# EAGLE design Duino Miner (EAGLE 9.6.2)
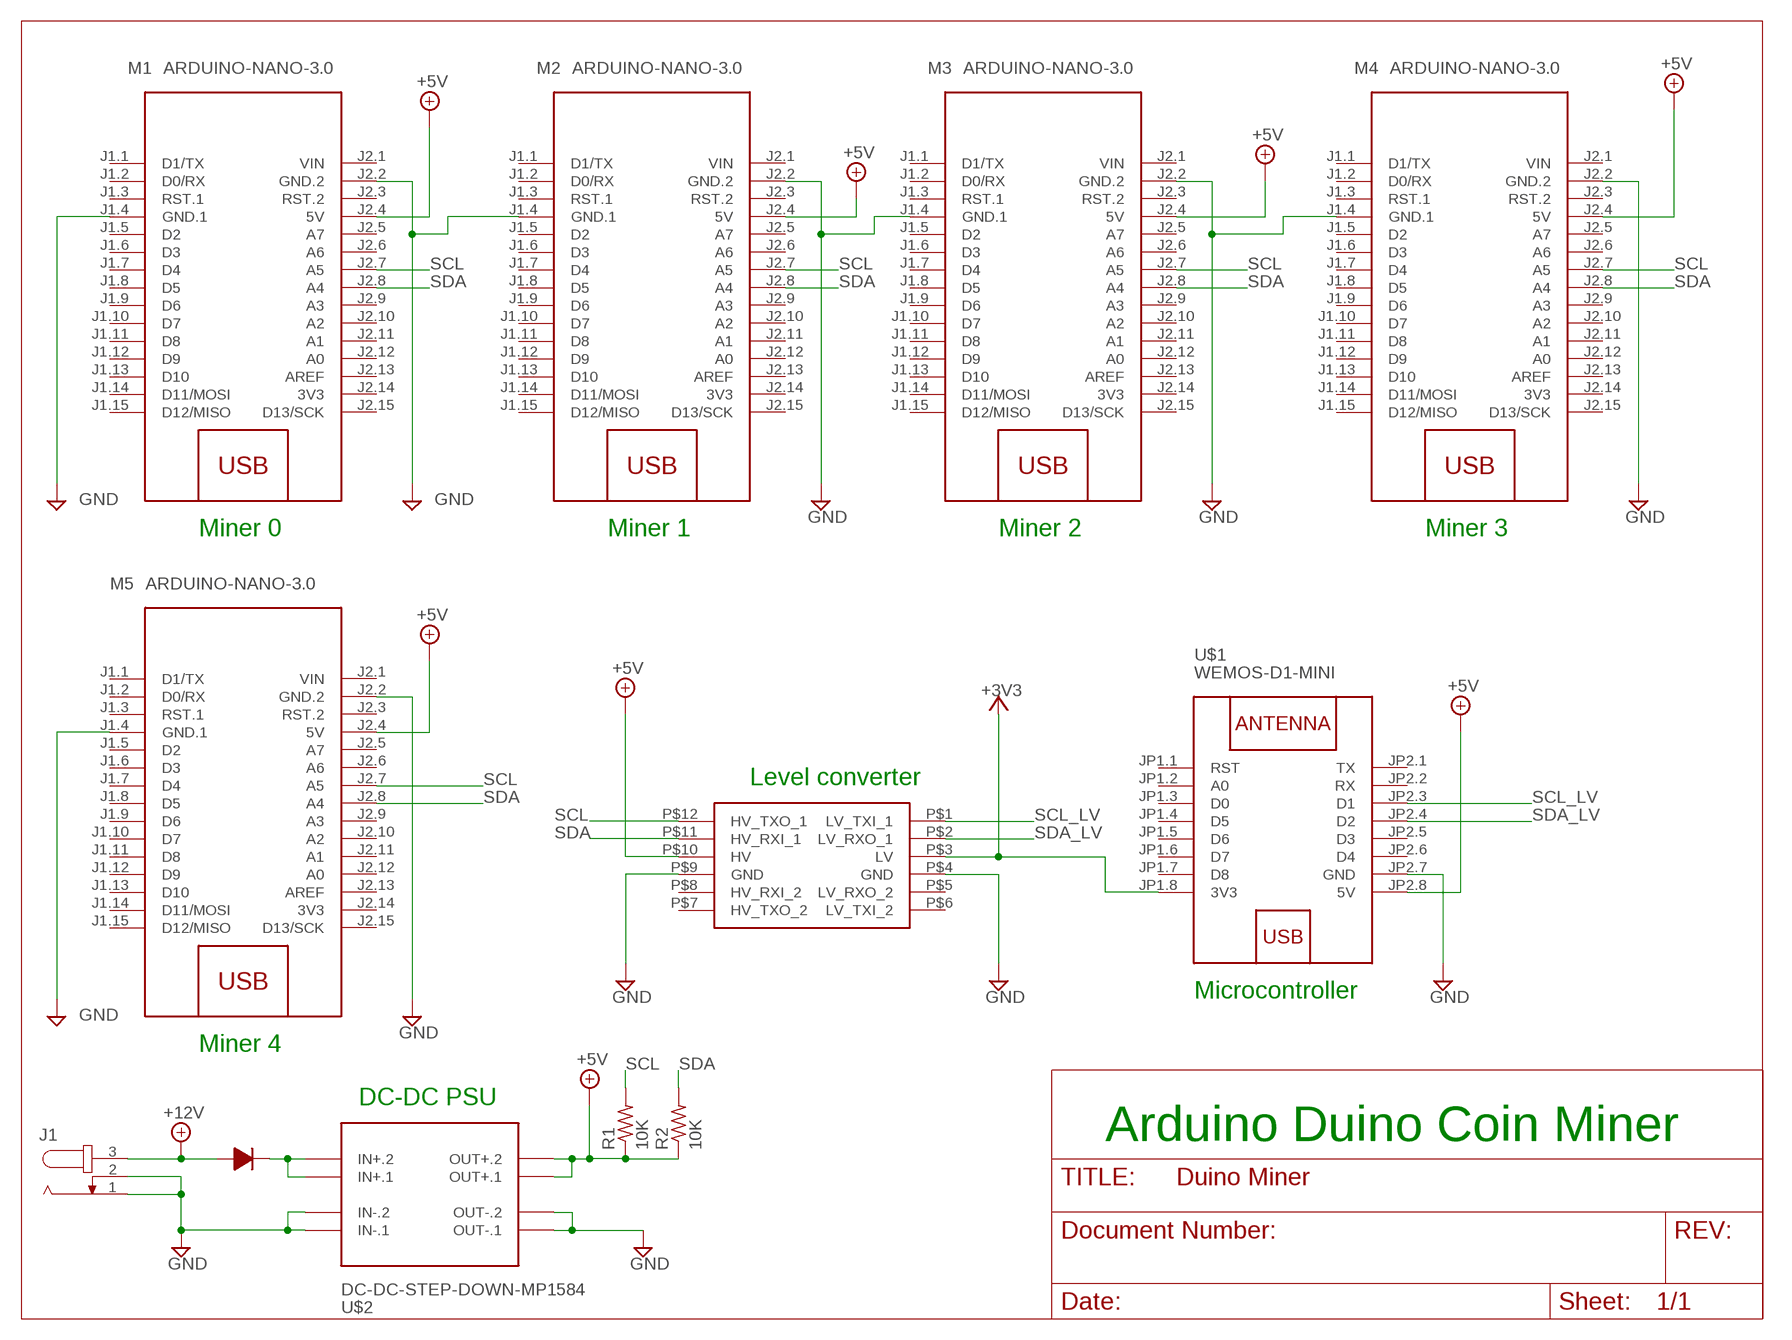
[diagram p0: schematic, sheet 1]

## Parts
J1  JACK-PLUG1  [SPC4078]
M1  ARDUINO-NANO-3.0  [ARDUINO-NANO-3.0]
M2  ARDUINO-NANO-3.0  [ARDUINO-NANO-3.0]
M3  ARDUINO-NANO-3.0  [ARDUINO-NANO-3.0]
M4  ARDUINO-NANO-3.0  [ARDUINO-NANO-3.0]
M5  ARDUINO-NANO-3.0  [ARDUINO-NANO-3.0]
R1  10K  R-US_0204/7  [0204/7]
R2  10K  R-US_0204/7  [0204/7]
U$1  WEMOS-D1-MINI  [WEMOS-D1-MINI]
U$2  DC-DC-STEP-DOWN-MP1584  [DC-DC-STEP-DOWN-MP1584]
U$3  LOGIC_LEVEL_CONVERTER  [LOGIC_LEVEL_CONVERTER]
U$4  1N4001  [DIODE-12.70]

## Nets
+3V3: U$1.JP1.8(3V3) U$3.P$3(LV)
+5V: M1.J2.4(5V) M2.J2.4(5V) M3.J2.4(5V) M4.J2.4(5V) M5.J2.4(5V) R1.1 R2.1 U$1.JP2.8(5V) U$2.OUT+.1 U$2.OUT+.2 U$3.P$10(HV)
+12V: J1.3 U$4.P$1
GND: J1.1 J1.2 M1.J1.4(GND.1) M1.J2.2(GND.2) M2.J1.4(GND.1) M2.J2.2(GND.2) M3.J1.4(GND.1) M3.J2.2(GND.2) M4.J1.4(GND.1) M4.J2.2(GND.2) M5.J1.4(GND.1) M5.J2.2(GND.2) U$1.JP2.7(GND) U$2.IN-.1 U$2.IN-.2 U$2.OUT-.1 U$2.OUT-.2 U$3.P$4(GND) U$3.P$9(GND)
N$2: U$2.IN+.1 U$2.IN+.2 U$4.P$2
SCL: M1.J2.7(A5) M2.J2.7(A5) M3.J2.7(A5) M4.J2.7(A5) M5.J2.7(A5) R1.2 U$3.P$12(HV_TXO_1)
SCL_LV: U$1.JP2.3(D1) U$3.P$1(LV_TXI_1)
SDA: M1.J2.8(A4) M2.J2.8(A4) M3.J2.8(A4) M4.J2.8(A4) M5.J2.8(A4) R2.2 U$3.P$11(HV_RXI_1)
SDA_LV: U$1.JP2.4(D2) U$3.P$2(LV_RXO_1)
Unconnected: M1.J1.1(D1/TX) M1.J1.2(D0/RX) M1.J1.3(RST.1) M1.J1.5(D2) M1.J1.6(D3) M1.J1.7(D4) M1.J1.8(D5) M1.J1.9(D6) M1.J1.10(D7) M1.J1.11(D8) M1.J1.12(D9) M1.J1.13(D10) M1.J1.14(D11/MOSI) M1.J1.15(D12/MISO) M1.J2.3(RST.2) M1.J2.5(A7) M1.J2.6(A6) M1.J2.9(A3) M1.J2.10(A2) M1.J2.11(A1) M1.J2.12(A0) M1.J2.13(AREF) M1.J2.15(D13/SCK) M2.J1.1(D1/TX) M2.J1.2(D0/RX) M2.J1.3(RST.1) M2.J1.5(D2) M2.J1.6(D3) M2.J1.7(D4) M2.J1.8(D5) M2.J1.9(D6) M2.J1.10(D7) M2.J1.11(D8) M2.J1.12(D9) M2.J1.13(D10) M2.J1.14(D11/MOSI) M2.J1.15(D12/MISO) M2.J2.3(RST.2) M2.J2.5(A7) M2.J2.6(A6) M2.J2.9(A3) M2.J2.10(A2) M2.J2.11(A1) M2.J2.12(A0) M2.J2.13(AREF) M2.J2.15(D13/SCK) M3.J1.1(D1/TX) M3.J1.2(D0/RX) M3.J1.3(RST.1) M3.J1.5(D2) M3.J1.6(D3) M3.J1.7(D4) M3.J1.8(D5) M3.J1.9(D6) M3.J1.10(D7) M3.J1.11(D8) M3.J1.12(D9) M3.J1.13(D10) M3.J1.14(D11/MOSI) M3.J1.15(D12/MISO) M3.J2.3(RST.2) M3.J2.5(A7) M3.J2.6(A6) M3.J2.9(A3) M3.J2.10(A2) M3.J2.11(A1) M3.J2.12(A0) M3.J2.13(AREF) M3.J2.15(D13/SCK) M4.J1.1(D1/TX) M4.J1.2(D0/RX) M4.J1.3(RST.1) M4.J1.5(D2) M4.J1.6(D3) M4.J1.7(D4) M4.J1.8(D5) M4.J1.9(D6) M4.J1.10(D7) M4.J1.11(D8) M4.J1.12(D9) M4.J1.13(D10) M4.J1.14(D11/MOSI) M4.J1.15(D12/MISO) M4.J2.3(RST.2) M4.J2.5(A7) M4.J2.6(A6) M4.J2.9(A3) M4.J2.10(A2) M4.J2.11(A1) M4.J2.12(A0) M4.J2.13(AREF) M4.J2.15(D13/SCK) M5.J1.1(D1/TX) M5.J1.2(D0/RX) M5.J1.3(RST.1) M5.J1.5(D2) M5.J1.6(D3) M5.J1.7(D4) M5.J1.8(D5) M5.J1.9(D6) M5.J1.10(D7) M5.J1.11(D8) M5.J1.12(D9) M5.J1.13(D10) M5.J1.14(D11/MOSI) M5.J1.15(D12/MISO) M5.J2.3(RST.2) M5.J2.5(A7) M5.J2.6(A6) M5.J2.9(A3) M5.J2.10(A2) M5.J2.11(A1) M5.J2.12(A0) M5.J2.13(AREF) M5.J2.15(D13/SCK) U$1.JP1.1(RST) U$1.JP1.2(A0) U$1.JP1.3(D0) U$1.JP1.4(D5) U$1.JP1.5(D6) U$1.JP1.6(D7) U$1.JP1.7(D8) U$1.JP2.1(TX) U$1.JP2.2(RX) U$1.JP2.5(D3) U$1.JP2.6(D4) U$3.P$5(LV_RXO_2) U$3.P$6(LV_TXI_2) U$3.P$7(HV_TXO_2) U$3.P$8(HV_RXI_2)

## Notes on the sheet
- Miner 0 | Miner 1 | Miner 2 | Miner 3
- Level converter
- Microcontroller
- Miner 4
- DC-DC PSU
- Arduino Duino Coin Miner

## Power pins joined to a net without a drawn wire
3V3: M1.J2.14(3V3) M2.J2.14(3V3) M3.J2.14(3V3) M4.J2.14(3V3) M5.J2.14(3V3)
VIN: M1.J2.1(VIN) M2.J2.1(VIN) M3.J2.1(VIN) M4.J2.1(VIN) M5.J2.1(VIN)

## Library data of the parts
J1 = con-jack:JACK-PLUG: DC POWER JACK Power Jack, DC, Right Angle, Through Hole, Rated 5A at 16VDC, PC Terminals Distributor: Farnell (www.Farnell.de) Drawing: 84N1161.pdf / 84N1162.pdf Manufacturer: SPC Technology (www.spctechnology.com) Type: SPC4077 / SPC 4078; OC_FARNELL: unknown; OC_NEWARK: unknown
M1-M5 = diy-modules:ARDUINO-NANO-3.0: Arduino Nano 3.0 and compatible devices More details available here: https://www.arduino.cc/en/Main/ArduinoBoardNano Click here to find device on ebay.com <http://www.ebay.com/sch/arduino+nano>
R1 R2 = rcl:R-US_: RESISTOR, American symbol; SPICEPREFIX: R
U$1 = diy-modules:WEMOS-D1-MINI: WEMOS D1 mini: Mini Wi-Fi Board based on ESP-8266 device More details can be found here: https://www.wemos.cc/product/d1-mini.html Click here to find device on ebay.com <http://www.ebay.com/sch/wemos+d1+mini+nodemcu>
U$2 = diy-modules:DC-DC-STEP-DOWN-MP1584: DC/DC Step-Down Regulator based on MP1584 chip MP1584 datasheet available here: http://www.haoyuelectronics.com/Attachment/MP1584/MP1584.pdf Click here to find device on ebay.com <http://www.ebay.com/sch/mp1584+module>
U$3 = SparkFun-Boards:LOGIC_LEVEL_CONVERTER: Logic Level Converter (3.3v - 5v) https://www.sparkfun.com/products/8745
U$4 = Oles komponentbibliotek:1N4001: 1N4001 diode

## Board
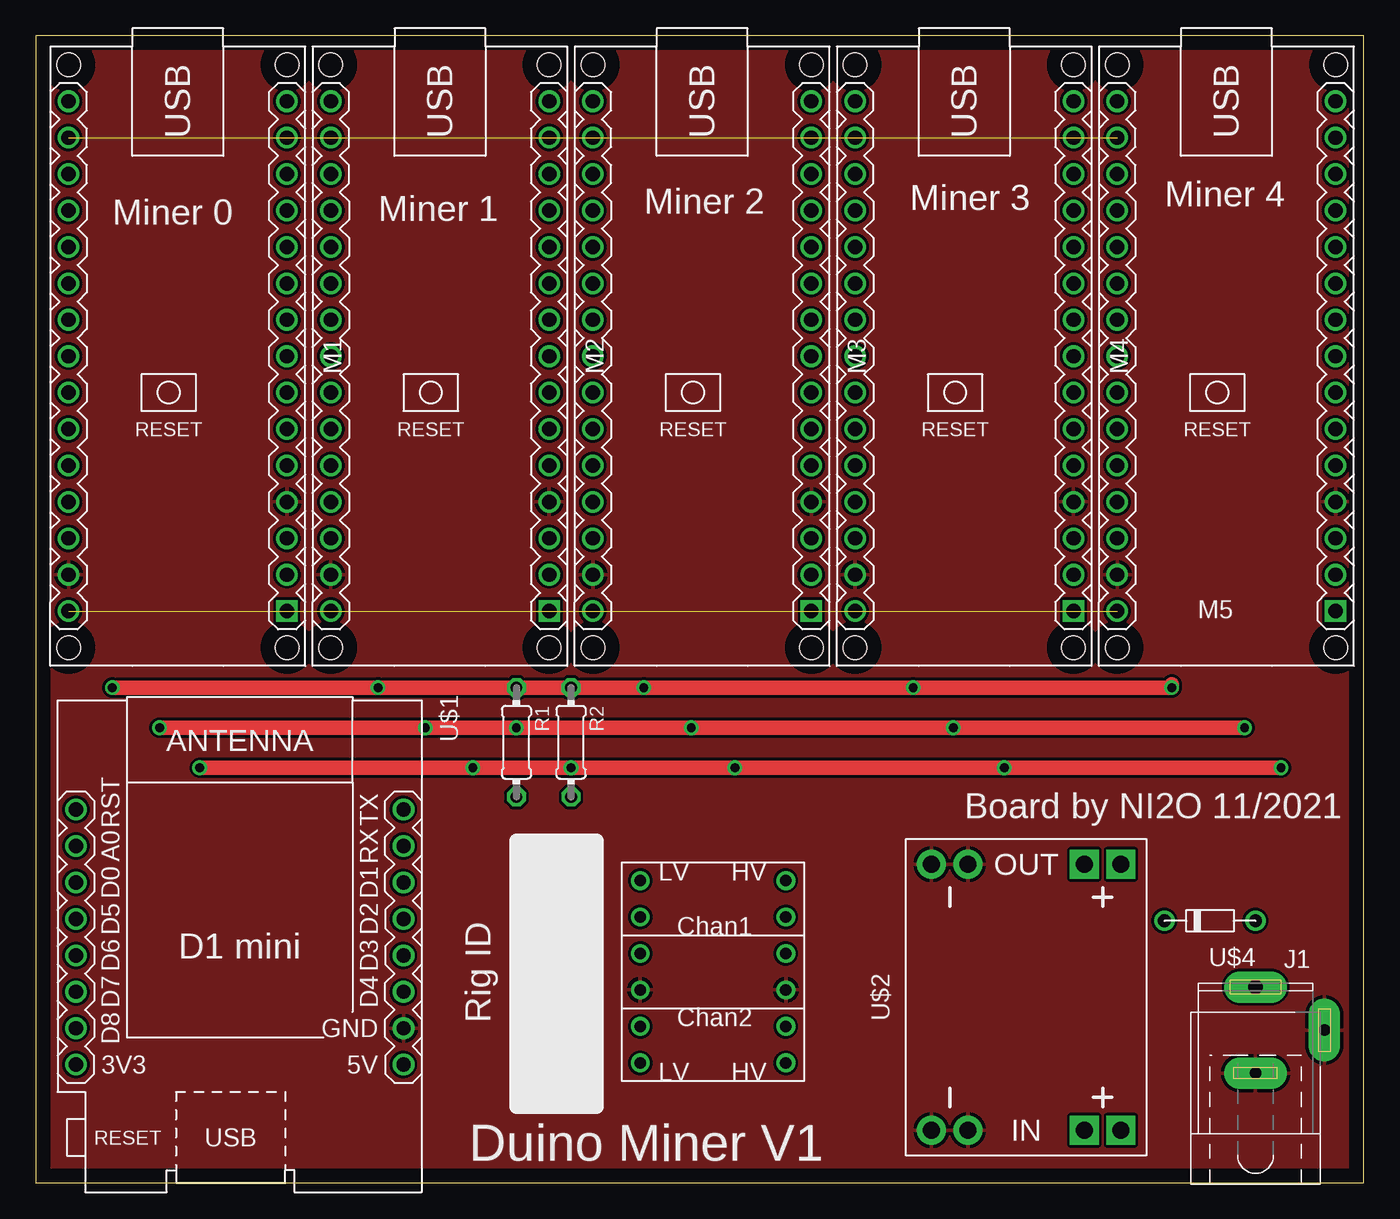
[diagram p1: board, top side]
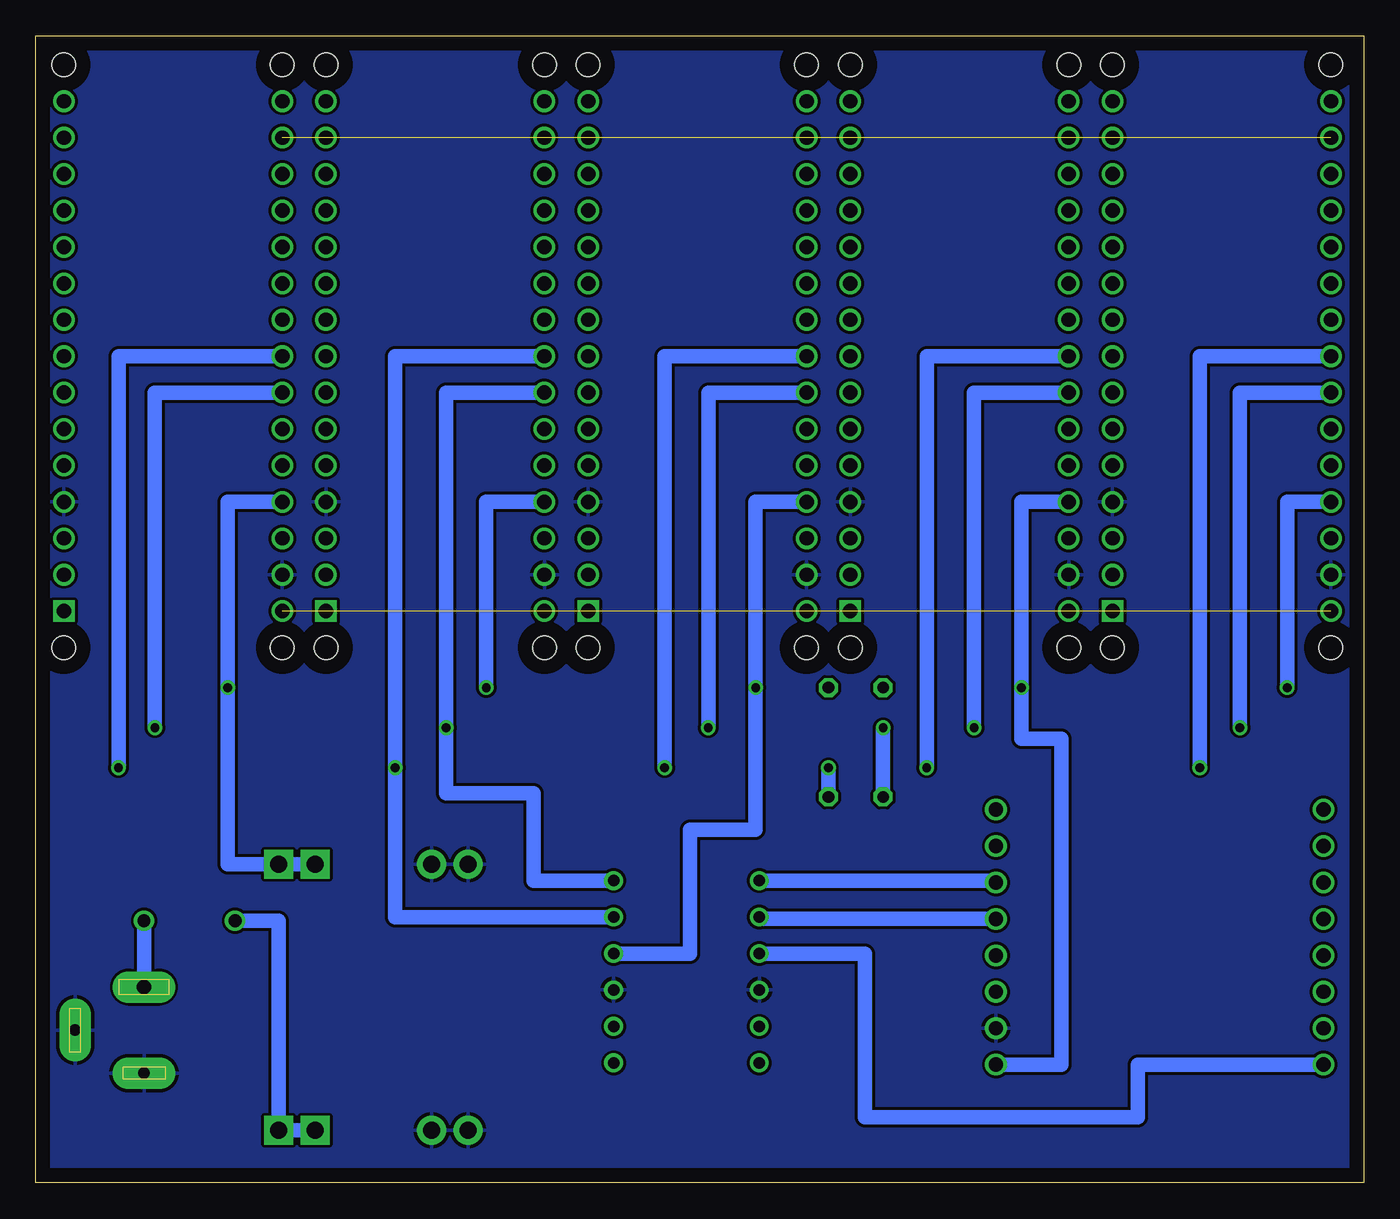
[diagram p2: board, bottom side, seen from below]

Size 92.63 x 80 mm. Coordinates in mm from the lower left corner, seen from the top.
Outline: 0,0 92.63,0 92.63,80 0,80 0,0
Copper layers (1*16): Top 0.035mm / dielectric 1.5mm / Bottom 0.035mm
Design rules "default": minimum track width 10mil, minimum drill 24mil, track to track 8mil, track to pad 8mil, pad to pad 8mil, via to via 8mil, smd to smd 8mil, copper to edge 40mil, drill to drill 8mil, minimum pad ring 10mil, minimum via ring 8mil, stop-mask expansion 4mil, vias tented up to drill 0mil, thermal gap 10mil

### Footprints (pad centres in the part's own frame; a part is rotated, then mirrored left to right if it is on the bottom)
SPC4078 = drill 0.8 pad 2.184 long: 1 -3,0; 2 0,-4.8 | drill 1 pad 2.184 long: 3 3,0
ARDUINO-NANO-3.0 = drill 1 square: J1.1 17.78,7.62 | drill 1: J1.2 15.24,7.62; J1.3 12.7,7.62; J1.4 10.16,7.62; J1.5 7.62,7.62; J1.6 5.08,7.62; J1.7 2.54,7.62; J1.8 0,7.62; J1.9 -2.54,7.62; J1.10 -5.08,7.62; J1.11 -7.62,7.62; J1.12 -10.16,7.62; J1.13 -12.7,7.62; J1.14 -15.24,7.62; J1.15 -17.78,7.62; J2.1 17.78,-7.62; J2.2 15.24,-7.62; J2.3 12.7,-7.62; J2.4 10.16,-7.62; J2.5 7.62,-7.62; J2.6 5.08,-7.62; J2.7 2.54,-7.62; J2.8 0,-7.62; J2.9 -2.54,-7.62; J2.10 -5.08,-7.62; J2.11 -7.62,-7.62; J2.12 -10.16,-7.62; J2.13 -12.7,-7.62; J2.14 -15.24,-7.62; J2.15 -17.78,-7.62 | hole 1.651: -20.32,7.62; -20.32,-7.62; 20.32,-7.62; 20.32,7.62
0204/7 = drill 0.813 octagon: 1 -3.81,0; 2 3.81,0
WEMOS-D1-MINI = drill 1: JP1.1 -11.43,9.525; JP1.2 -11.43,6.985; JP1.3 -11.43,4.445; JP1.4 -11.43,1.905; JP1.5 -11.43,-0.635; JP1.6 -11.43,-3.175; JP1.7 -11.43,-5.715; JP1.8 -11.43,-8.255; JP2.1 11.43,9.525; JP2.2 11.43,6.985; JP2.3 11.43,4.445; JP2.4 11.43,1.905; JP2.5 11.43,-0.635; JP2.6 11.43,-3.175; JP2.7 11.43,-5.715; JP2.8 11.43,-8.255
DC-DC-STEP-DOWN-MP1584 = drill 1.2 pad 2 square: IN+.1 -9.271,-4.064; IN+.2 -9.271,-6.604; OUT+.1 9.271,-4.064; OUT+.2 9.271,-6.604 | drill 1.2 pad 2: IN-.1 -9.271,6.604; IN-.2 -9.271,4.064; OUT-.1 9.271,6.604; OUT-.2 9.271,4.064
LOGIC_LEVEL_CONVERTER = drill 0.8: P$1 1.27,13.97; P$2 1.27,11.43; P$3 1.27,8.89; P$4 1.27,6.35; P$5 1.27,3.81; P$6 1.27,1.27; P$7 11.43,1.27; P$8 11.43,3.81; P$9 11.43,6.35; P$10 11.43,8.89; P$11 11.43,11.43; P$12 11.43,13.97
DIODE-12.70 = drill 0.9: P$1 -3.81,0; P$2 2.54,0

### Placement (x,y rotation side)
J1  85.09,10.67 90 top
M1  9.91,57.66 270 top
M2  28.19,57.66 270 top
M3  46.48,57.66 270 top
M4  64.77,57.66 270 top
M5  83.06,57.66 270 top
R1  33.53,30.73 270 top
R2  37.34,30.73 270 top
U$1  14.22,16.51 0 top
U$2  69.09,12.95 90 top
U$3  40.89,7.11 0 top
U$4  81.28,18.29 180 top

### Tracks (layer width: path | path; a pad name or v marks a point on that pad's centre or on a via)
3V3  (4 unrouted)
+3V3
  Bottom 1.016: U$1.JP1.8 15.75,8.26 15.75,4.57 34.8,4.57 34.8,16 U$3.P$3
+5V  (via drill 0.61)
  Top 1.016: 79.25,34.8 v79.25,34.54 v61.21,34.54 v42.42,34.54 R2.1 R1.1 v23.88,34.54 v5.33,34.54
  Bottom 1.016: M1.J2.4 5.33,47.5 v5.33,34.54 | M2.J2.4 23.88,47.5 v23.88,34.54 23.88,30.99 21.08,30.99 21.08,8.26 U$1.JP2.8 | M3.J2.4 42.42,47.5 v42.42,34.54 42.42,24.64 46.99,24.64 46.99,16 U$3.P$10 | M4.J2.4 61.21,47.5 v61.21,34.54 | M5.J2.4 79.25,47.5 v79.25,34.54 79.25,22.23 U$2.OUT+.2 U$2.OUT+.1
+12V
  Bottom 1.016: J1.3 U$4.P$1
GND
  pour Top: 92.71,-0.25 92.71,80.01 0,80.01 0,0
  pour Bottom: 0,0 0,80.01 92.46,80.01 92.46,0
N$2
  Bottom 1.016: U$4.P$2 75.69,18.29 U$2.IN+.2 U$2.IN+.1
SCL  (via drill 0.61)
  Top 1.016: v64.01,31.75 v45.72,31.75 v33.53,31.75 v27.18,31.75 v8.64,31.75 | v64.01,31.75 69.47,31.75 | v84.33,31.75 v64.01,31.75
  Bottom 1.016: M1.J2.7 8.64,55.12 v8.64,31.75 | M2.J2.7 27.18,55.12 v27.18,31.75 | M3.J2.7 45.72,55.12 v45.72,31.75 | M4.J2.7 64.01,55.12 v64.01,31.75 64.01,27.18 57.91,27.18 57.91,21.08 U$3.P$12 | R1.2 v33.53,31.75 | M5.J2.7 84.33,55.12 v84.33,31.75
SCL_LV
  Bottom 1.016: U$3.P$1 25.65,21.08 U$1.JP2.3
SDA  (via drill 0.61)
  Top 1.016: v11.43,28.96 v30.48,28.96 v37.34,28.96 v48.77,28.96 v67.56,28.96 v86.87,28.96
  Bottom 1.016: M1.J2.8 11.43,57.66 v11.43,28.96 | M2.J2.8 30.48,57.66 v30.48,28.96 | M3.J2.8 48.77,57.66 v48.77,28.96 | M4.J2.8 67.56,57.66 v67.56,28.96 67.56,18.54 U$3.P$11 | R2.2 v37.34,28.96 | M5.J2.8 86.87,57.66 v86.87,28.96
SDA_LV
  Bottom 1.016: U$1.JP2.4 42.16,18.41 U$3.P$2
VIN  (4 unrouted)

### Text on the board
tNames: Miner 2 | Miner 3 | Miner 4 | Miner 0 | Miner 1 | Board by NI2O 11/2021 | Rig ID | Duino Miner V1